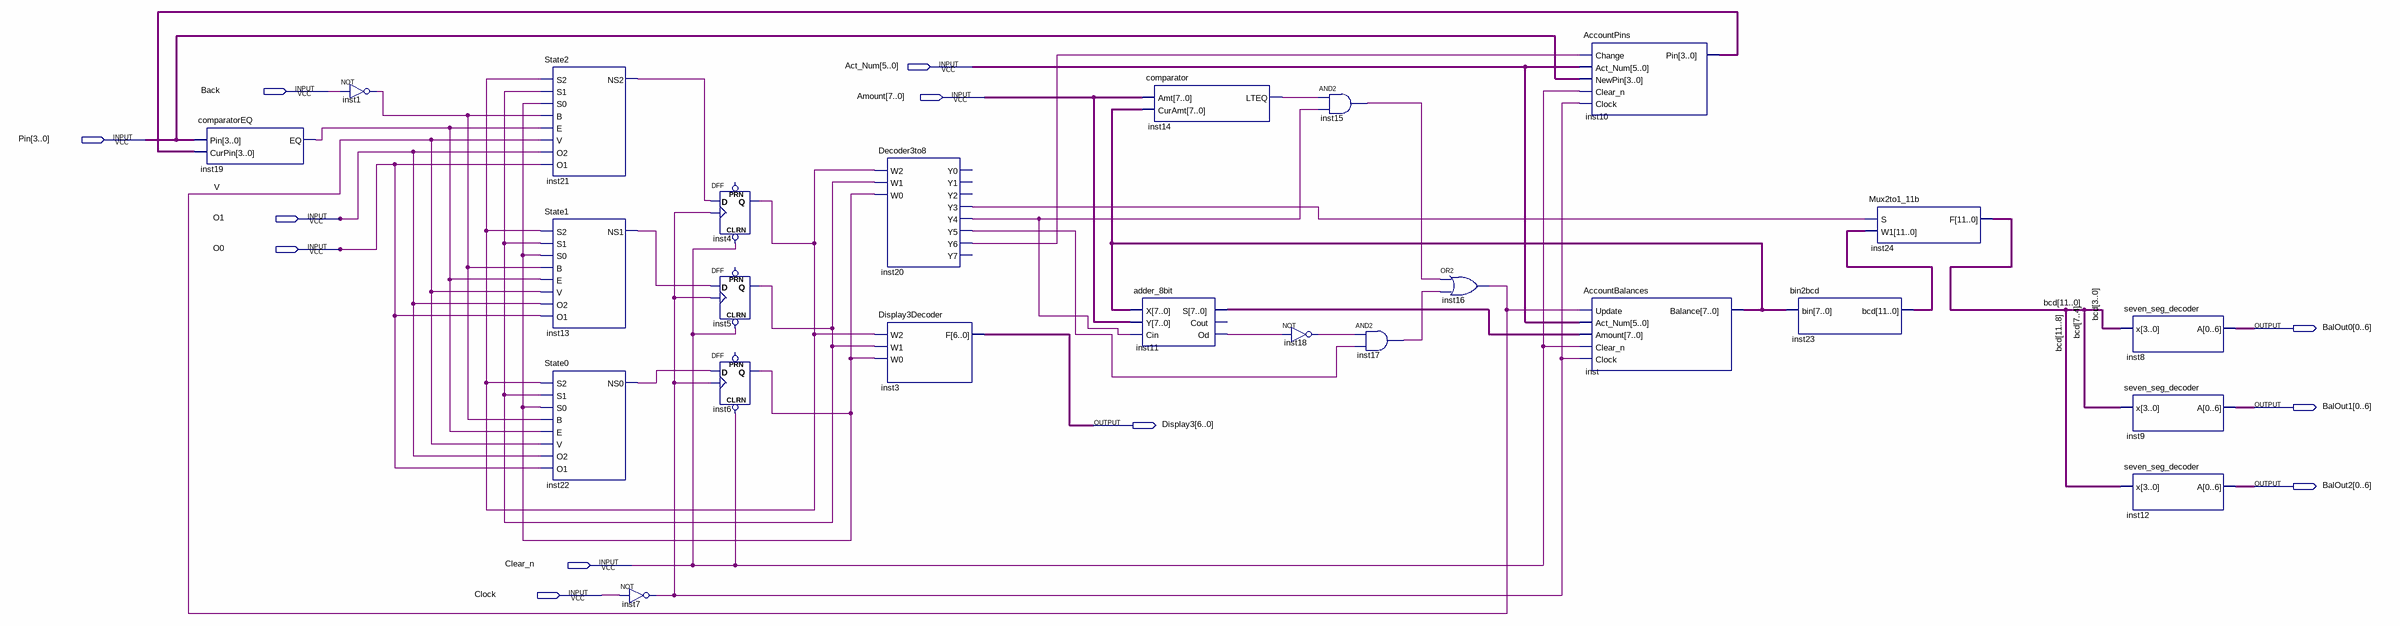
[diagram p0: schematic sheet]
// Quartus schematic ATM.bdf as structural Verilog: 24 symbols, 12 pins
module ATM (
  input  [5:0] Act_Num,
  input  Back,
  input  [7:0] Amount,
  input  [3:0] Pin,
  input  O1,
  input  O0,
  input  Clear_n,
  input  Clock,
  output [0:6] BalOut0,
  output [0:6] BalOut1,
  output [6:0] Display3,
  output [0:6] BalOut2
);

  wire inst1_out, inst4_q, inst5_q, inst6_q, inst7_out, inst11_od, inst13_ns1, inst14_lteq, inst15_out,
       inst17_out, inst18_out, inst19_eq, inst20_y3, inst20_y4, inst20_y5, inst20_y6, inst21_ns2, inst22_ns0,
       V;
  wire [3:0] inst10_pin;
  wire [7:0] inst11_s, inst_balance;
  wire [11:0] bcd, inst23_bcd;

  comparatorEQ inst19 (.Pin(Pin), .CurPin(inst10_pin), .EQ(inst19_eq));
  not inst1 (inst1_out, Back);
  State2 inst21 (
    .S2(inst4_q), .S1(inst5_q), .S0(inst6_q), .B(inst1_out), .E(inst19_eq), .V(V), .O2(O1), .O1(O0),
    .NS2(inst21_ns2));
  State1 inst13 (
    .S2(inst4_q), .S1(inst5_q), .S0(inst6_q), .B(inst1_out), .E(inst19_eq), .V(V), .O2(O1), .O1(O0),
    .NS1(inst13_ns1));
  State0 inst22 (
    .S2(inst4_q), .S1(inst5_q), .S0(inst6_q), .B(inst1_out), .E(inst19_eq), .V(V), .O2(O1), .O1(O0),
    .NS0(inst22_ns0));
  not inst7 (inst7_out, Clock);
  DFF inst4 (.CLRN(Clear_n), .CLK(inst7_out), .D(inst21_ns2), .Q(inst4_q));  // open: PRN
  DFF inst5 (.CLRN(Clear_n), .CLK(inst7_out), .D(inst13_ns1), .Q(inst5_q));  // open: PRN
  DFF inst6 (.CLRN(Clear_n), .CLK(inst7_out), .D(inst22_ns0), .Q(inst6_q));  // open: PRN
  Decoder3to8 inst20 (
    .W2(inst4_q), .W1(inst5_q), .W0(inst6_q), .Y3(inst20_y3), .Y4(inst20_y4), .Y5(inst20_y5), .Y6(inst20_y6));  // open: Y0, Y1, Y2, Y7
  Display3Decoder inst3 (.W2(inst4_q), .W1(inst5_q), .W0(inst6_q), .F(Display3));
  comparator inst14 (.Amt(Amount), .CurAmt(inst_balance), .LTEQ(inst14_lteq));
  adder_8bit inst11 (.X(inst_balance), .Y(Amount), .Cin(inst20_y4), .S(inst11_s), .Od(inst11_od));  // open: Cout
  not inst18 (inst18_out, inst11_od);
  and inst15 (inst15_out, inst14_lteq, inst20_y4);
  and inst17 (inst17_out, inst18_out, inst20_y5);
  or inst16 (V, inst15_out, inst17_out);
  AccountPins inst10 (
    .Change(inst20_y6), .Act_Num(Act_Num), .NewPin(Pin), .Clear_n(Clear_n), .Clock(inst7_out),
    .Pin(inst10_pin));
  AccountBalances inst (
    .Update(V), .Act_Num(Act_Num), .Amount(inst11_s), .Clear_n(Clear_n), .Clock(inst7_out),
    .Balance(inst_balance));
  bin2bcd inst23 (.bin(inst_balance), .bcd(inst23_bcd));
  Mux2to1_11b inst24 (.S(inst20_y3), .W1(inst23_bcd), .F(bcd));
  seven_seg_decoder inst8 (.x(bcd[3:0]), .A(BalOut0));
  seven_seg_decoder inst9 (.x(bcd[7:4]), .A(BalOut1));
  seven_seg_decoder inst12 (.x(bcd[11:8]), .A(BalOut2));
endmodule
